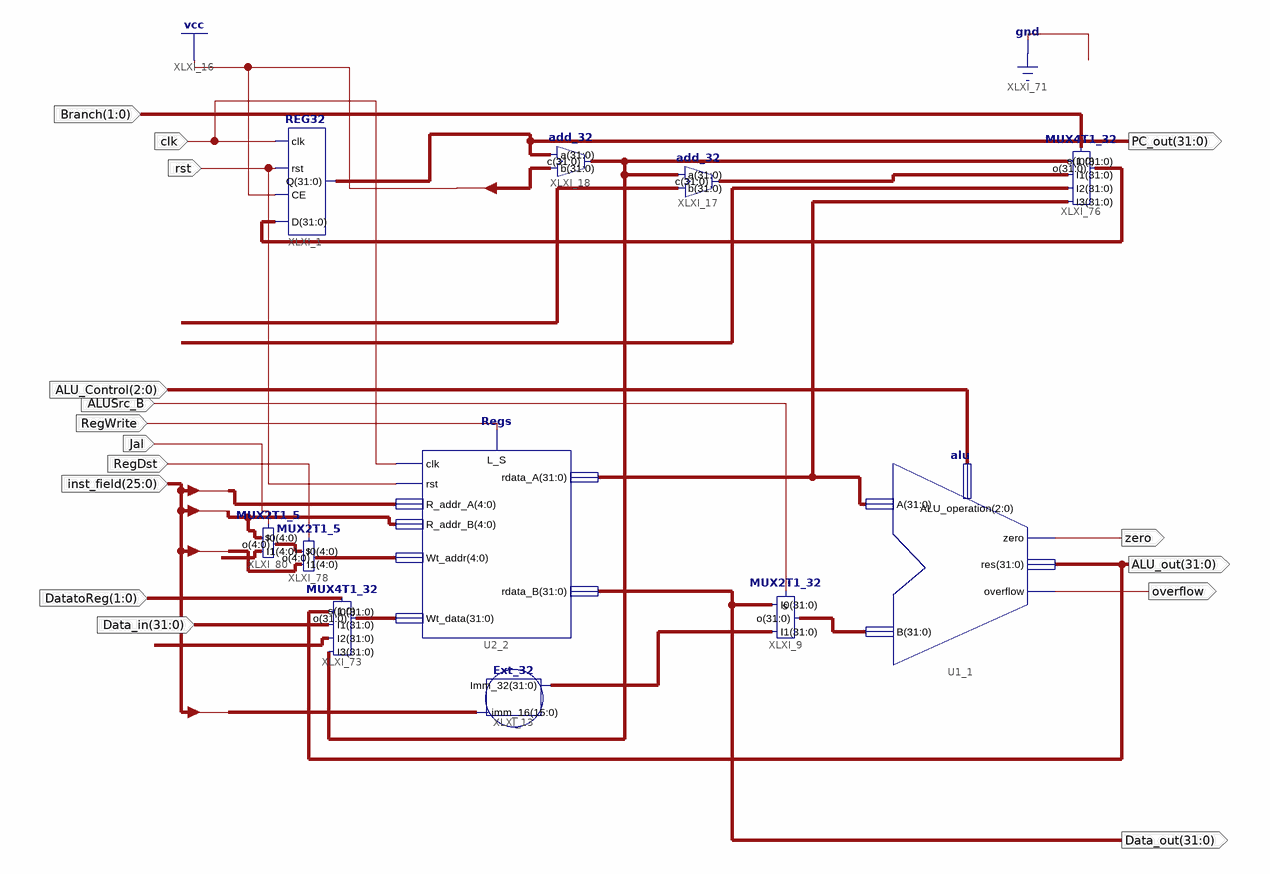
[diagram p0: schematic sheet 1]
// Xilinx ISE schematic Data_path.sch (kintex7) as structural Verilog: 11 symbols, 16 ports
module Data_path (
  input  [25:0] inst_field,
  input  RegDst,
  input  clk,
  input  [31:0] Data_in,
  input  [2:0] ALU_Control,
  input  rst,
  input  RegWrite,
  input  ALUSrc_B,
  input  [1:0] DatatoReg,
  input  Jal,
  input  [1:0] Branch,
  output [31:0] Data_out,
  output [31:0] ALU_out,
  output [31:0] PC_out,
  output zero,
  output overflow
);

  wire [4:0] XLXN_43, XLXN_237;
  wire [31:0] branch_pc, Imm_32, pc_4, XLXN_37, XLXN_39, XLXN_41, XLXN_242;

  Regs U2_2 (
    .clk(clk), .L_S(RegWrite), .rdata_A(XLXN_39), .rst(rst), .Wt_data(XLXN_41), .rdata_B(Data_out),
    .R_addr_A(inst_field[25:21]), .R_addr_B(inst_field[20:16]), .Wt_addr(XLXN_43));
  alu U1_1 (.zero(zero), .res(ALU_out), .overflow(overflow), .A(XLXN_39), .B(XLXN_37), .ALU_operation(ALU_Control));
  add_32 XLXI_17 (.c(branch_pc), .a(pc_4), .b({Imm_32[29:0], 2'b00}));
  add_32 XLXI_18 (.c(pc_4), .a(PC_out), .b(32'b00000000000000000000000000000100));
  Ext_32 XLXI_13 (.imm_16(inst_field[15:0]), .Imm_32(Imm_32));
  MUX2T1_32 XLXI_9 (.s(ALUSrc_B), .I0(Data_out), .I1(Imm_32), .o(XLXN_37));
  REG32 XLXI_1 (.D(XLXN_242), .CE(1'b1), .rst(rst), .clk(clk), .Q(PC_out));
  MUX4T1_32 XLXI_73 (
    .s(DatatoReg), .I0(ALU_out), .I1(Data_in), .I2({inst_field[15:0], {16{1'b0}}}), .I3(pc_4), .o(XLXN_41));
  MUX4T1_32 XLXI_76 (
    .s(Branch), .I0(pc_4), .I1(branch_pc), .I2({pc_4[31:28], inst_field, 2'b00}), .I3(XLXN_39), .o(XLXN_242));
  MUX2T1_5 XLXI_78 (.I1(inst_field[15:11]), .I0(XLXN_237), .o(XLXN_43), .s(RegDst));
  MUX2T1_5 XLXI_80 (.I1({5{1'b1}}), .I0(inst_field[20:16]), .o(XLXN_237), .s(Jal));
endmodule
